# Altium schematic sheet Host_FPGA.SchDoc: Host Controller - Altera - EP3C10
size A2; Organization: Altium Limited.; Revision: 6; PageSetup: Record=PageOptions|CenterHorizontal=True|CenterVertical=True|PrintScale=0.47|XCorrection=1.00|YCorrection=1.00|PrintKind=0|BorderSize=5000000|LeftOffset=0|BottomOffset=0|Orientation=2|PaperLength=1000|PaperWidth=1000|Scale=100|PaperSource=7|PrintQuality=1200|MediaType=1|DitherType=10|PaperKind=A4 (210 x 297 mm)|PrintScaleMode=1
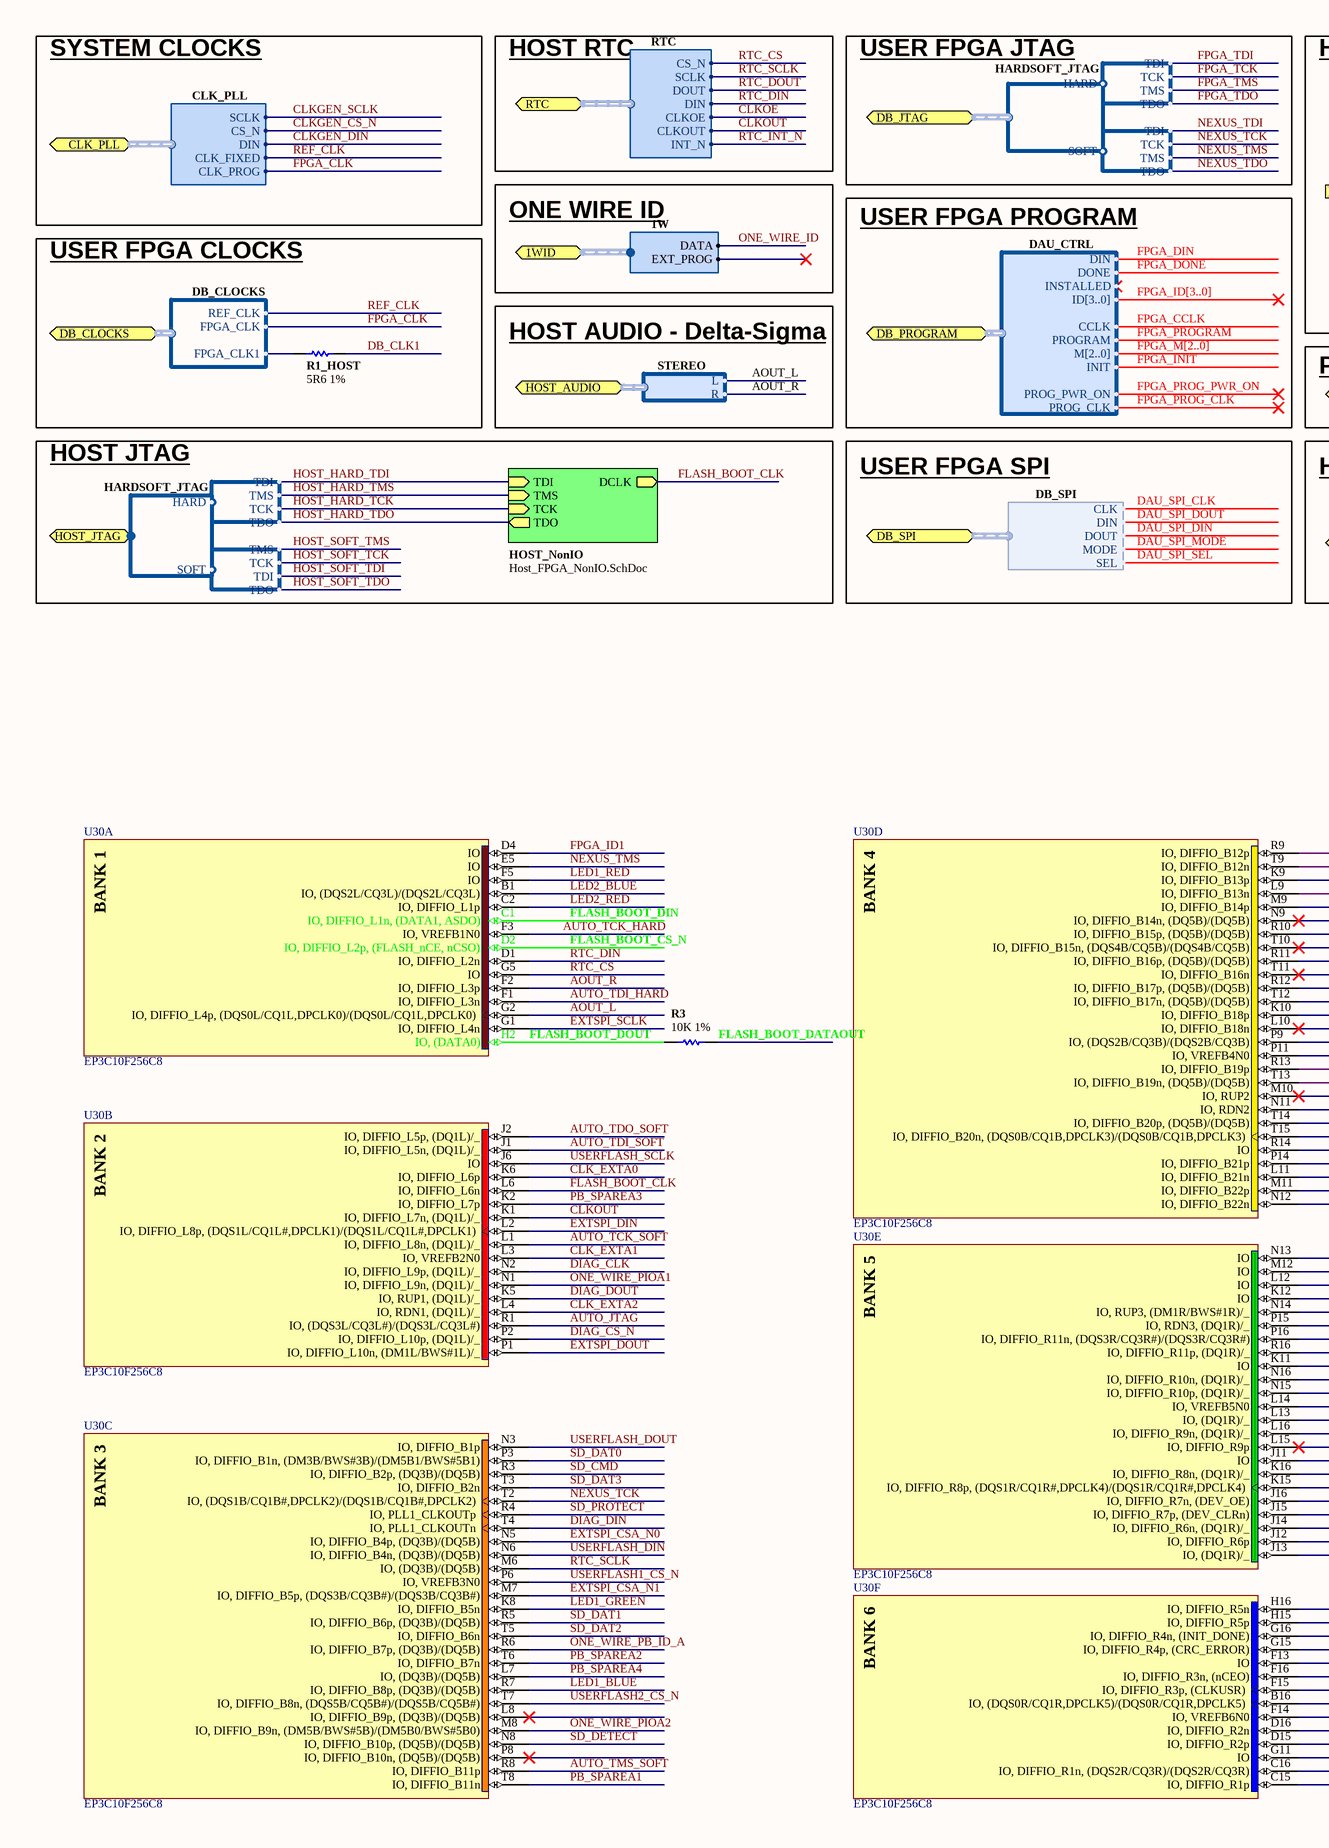
[diagram p0: Host_FPGA.SchDoc, left]
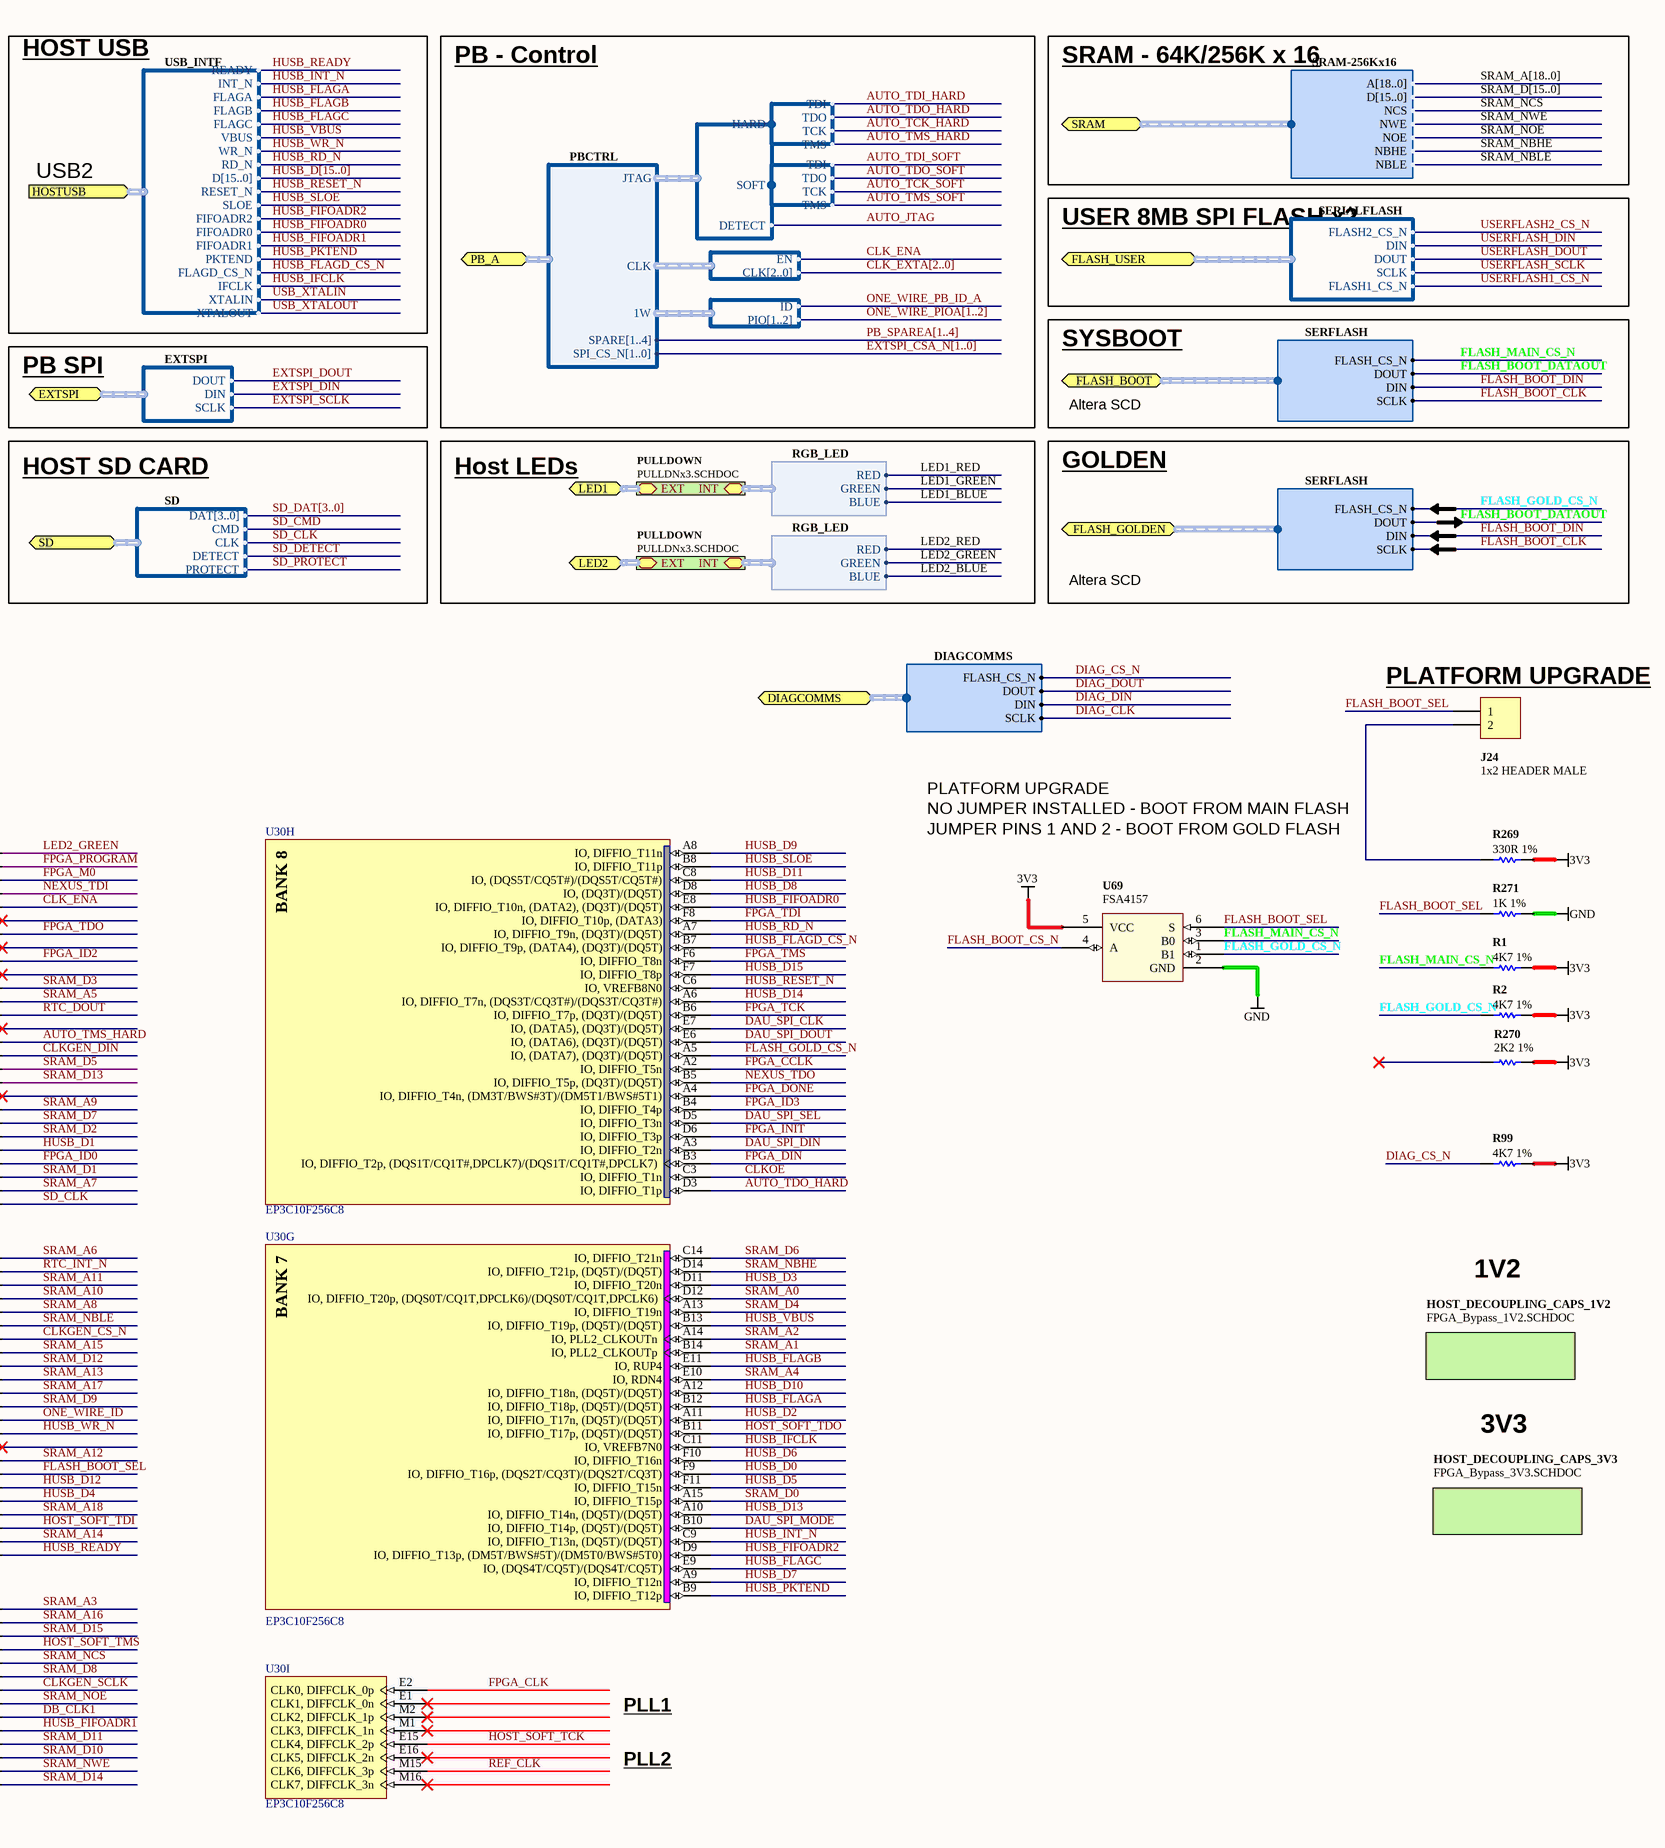
[diagram p1: Host_FPGA.SchDoc, right]

## Parts
J24  1x2 HEADER MALE  [HDR1X2]
R1  4K7 1%  [RESC1005-STAR]
R1_HOST  5R6 1%  [RESC1005-STAR]
R2  4K7 1%  [RESC1005-STAR]
R3  10K 1%  [RESC1005-STAR]
R99  4K7 1%  [RESC1005-STAR]
R269  330R 1%  [RESC1005-STAR]
R270  2K2 1%  [RESC1005-STAR]
R271  1K 1%  [RESC1005-STAR]
U30  EP3C10F256C8  [FBGA256-2]  (parts A,B,C,D,E,F,G,H,I of 13)
U69  FSA4157  [SC70_6L]

## Blocks framed on the sheet
USER FPGA CLOCKS: R1_HOST

## Sub-sheets
HOST_DECOUPLING_CAPS_1V2 = FPGA_Bypass_1V2.SCHDOC: no entries
HOST_DECOUPLING_CAPS_3V3 = FPGA_Bypass_3V3.SCHDOC: no entries
HOST_NonIO = Host_FPGA_NonIO.SchDoc: TMS (in), TCK (in), TDI (in), TDO (out), DCLK (out)
PULLDOWN = PULLDNx3.SCHDOC: EXT, INT (harness RGB_LED)
PULLDOWN = PULLDNx3.SCHDOC: EXT, INT (harness RGB_LED)

## Ports
1WID (harness 1W), CLK_PLL (harness CLK_PLL), DB_CLOCKS (harness DB_CLOCKS), DB_JTAG (harness HARDSOFT_JTAG), DB_PROGRAM (harness DAU_CTRL), DB_SPI (harness DB_SPI), DIAGCOMMS (harness DIAGCOMMS), EXTSPI (harness EXTSPI), FLASH_BOOT (harness SERFLASH), FLASH_GOLDEN (harness SERFLASH), FLASH_USER (harness SERIALFLASH), HOST_AUDIO (harness STEREO), HOST_JTAG (harness HARDSOFT_JTAG), HOSTUSB (harness USB_INTF), LED1 (harness RGB_LED), LED2 (harness RGB_LED), PB_A (harness PBCTRL), RTC (harness RTC), SD (harness SD), SRAM (harness SRAM-256Kx16)

## Harnesses
SERIALFLASH: FLASH2_CS_N, DIN, DOUT, SCLK, FLASH1_CS_N
JTAG: TMS, TDO, TDI, TCK
HARDSOFT_JTAG: HARD, SOFT
SD: DAT[3..0], CMD, CLK, DETECT, PROTECT
STEREO: L, R
RTC: CS_N, DIN, DOUT, INT_N, SCLK, CLKOUT, CLKOE
DAU_CTRL: DIN, DONE, INSTALLED, ID[3..0], CCLK, PROGRAM, M[2..0], INIT, PROG_PWR_ON, PROG_CLK
1W: DATA, EXT_PROG
CLK_PLL: CLK_FIXED, CLK_PROG, CS_N, DIN, SCLK
SRAM-256Kx16: A[18..0], D[15..0], NCS, NWE, NOE, NBHE, NBLE
RGB_LED: GREEN, RED, BLUE
DB_CLOCKS: REF_CLK, FPGA_CLK, FPGA_CLK1
DB_SPI: MODE, SEL, CLK, DIN, DOUT
JTAG_CONFIG: HARD, SOFT, DETECT
JTAG: TDI, TDO, TCK, TMS
GATE_CLOCKS: EN, CLK[2..0]
ONE_WIRE: ID, PIO[1..2]
PBCTRL: JTAG, CLK, 1W, SPI_CS_N[1..0], SPARE[1..4]
EXTSPI: DOUT, DIN, SCLK
SERFLASH: DIN, DOUT, SCLK, FLASH_CS_N
USB_INTF: READY, INT_N, SLOE, FIFOADR2, FIFOADR0, FIFOADR1, PKTEND, FLAGD_CS_N, FLAGA, FLAGB, FLAGC, WR_N, RD_N, D[15..0], RESET_N, IFCLK, XTALIN, VBUS, XTALOUT
DIAGCOMMS: DIN, DOUT, SCLK, FLASH_CS_N

## Nets
3V3: R1.2 R2.2 R99.2 R269.2 R270.2 U69.5(VCC)
GND: R271.2 U69.2(GND)
AOUT_L: U30.G2(IO,_DIFFIO_L4p,_(DQS0L/CQ1L,DPCLK0)/(DQS0L/CQ1L,DPCLK0)) ; port HOST_AUDIO.L
AOUT_R: U30.F2(IO,_DIFFIO_L3p) ; port HOST_AUDIO.R
AUTO_JTAG: U30.R1(IO,_(DQS3L/CQ3L#)/(DQS3L/CQ3L#)) ; harness JTAG_CONFIG.DETECT
AUTO_TCK_HARD: U30.F3(IO,_VREFB1N0) ; harness JTAG.TCK
AUTO_TCK_SOFT: U30.L1(IO,_DIFFIO_L8n,_(DQ1L)/_) ; harness JTAG.TCK
AUTO_TDI_HARD: U30.F1(IO,_DIFFIO_L3n) ; harness JTAG.TDI
AUTO_TDI_SOFT: U30.J1(IO,_DIFFIO_L5n,_(DQ1L)/_) ; harness JTAG.TDI
AUTO_TDO_HARD: U30.D3(IO,_DIFFIO_T1p) ; harness JTAG.TDO
AUTO_TDO_SOFT: U30.J2(IO,_DIFFIO_L5p,_(DQ1L)/_) ; harness JTAG.TDO
AUTO_TMS_HARD: U30.P9(IO,_(DQS2B/CQ3B)/(DQS2B/CQ3B)) ; harness JTAG.TMS
AUTO_TMS_SOFT: U30.R8(IO,_DIFFIO_B11p) ; harness JTAG.TMS
CLK_ENA: U30.M9(IO,_DIFFIO_B14p) ; harness GATE_CLOCKS.EN
CLK_EXTA0: U30.K6(IO,_DIFFIO_L6p)
CLK_EXTA1: U30.L3(IO,_VREFB2N0)
CLK_EXTA2: U30.L4(IO,_RDN1,_(DQ1L)/_)
CLKGEN_CS_N: U30.P16(IO,_DIFFIO_R11n,_(DQS3R/CQ3R#)/(DQS3R/CQ3R#)) ; port CLK_PLL.CS_N
CLKGEN_DIN: U30.P11(IO,_VREFB4N0) ; port CLK_PLL.DIN
CLKGEN_SCLK: U30.F15(IO,_DIFFIO_R3p,_(CLKUSR)) ; port CLK_PLL.SCLK
CLKOE: U30.C3(IO,_DIFFIO_T1n) ; port RTC.CLKOE
CLKOUT: U30.K1(IO,_DIFFIO_L7n,_(DQ1L)/_) ; port RTC.CLKOUT
DAU_SPI_CLK: U30.E7(IO,_(DATA5),_(DQ3T)/(DQ5T)) ; port DB_SPI.CLK
DAU_SPI_DIN: U30.A3(IO,_DIFFIO_T2n) ; port DB_SPI.DOUT
DAU_SPI_DOUT: U30.E6(IO,_(DATA6),_(DQ3T)/(DQ5T)) ; port DB_SPI.DIN
DAU_SPI_MODE: U30.B10(IO,_DIFFIO_T14p,_(DQ5T)/(DQ5T)) ; port DB_SPI.MODE
DAU_SPI_SEL: U30.D5(IO,_DIFFIO_T3n) ; port DB_SPI.SEL
DB_CLK1: R1_HOST.1 U30.F14(IO,_VREFB6N0)
DIAG_CLK: U30.N2(IO,_DIFFIO_L9p,_(DQ1L)/_) ; port DIAGCOMMS.SCLK
DIAG_CS_N: R99.1 U30.P2(IO,_DIFFIO_L10p,_(DQ1L)/_) ; port DIAGCOMMS.FLASH_CS_N
DIAG_DIN: U30.T4(IO,_PLL1_CLKOUTn) ; port DIAGCOMMS.DIN
DIAG_DOUT: U30.K5(IO,_RUP1,_(DQ1L)/_) ; port DIAGCOMMS.DOUT
EXTSPI_CSA_N0: U30.N5(IO,_DIFFIO_B4p,_(DQ3B)/(DQ5B))
EXTSPI_CSA_N1: U30.M7(IO,_DIFFIO_B5p,_(DQS3B/CQ3B#)/(DQS3B/CQ3B#))
EXTSPI_DIN: U30.L2(IO,_DIFFIO_L8p,_(DQS1L/CQ1L#,DPCLK1)/(DQS1L/CQ1L#,DPCLK1)) ; port EXTSPI.DIN
EXTSPI_DOUT: U30.P1(IO,_DIFFIO_L10n,_(DM1L/BWS#1L)/_) ; port EXTSPI.DOUT
EXTSPI_SCLK: U30.G1(IO,_DIFFIO_L4n) ; port EXTSPI.SCLK
FLASH_BOOT_CLK: U30.L6(IO,_DIFFIO_L6n) ; sheet HOST_NonIO/DCLK, port FLASH_BOOT.SCLK, port FLASH_GOLDEN.SCLK
FLASH_BOOT_CS_N: U30.D2(IO,_DIFFIO_L2p,_(FLASH_nCE,_nCSO)) U69.4(A)
FLASH_BOOT_DATAOUT: R3.2 ; port FLASH_BOOT.DOUT, port FLASH_GOLDEN.DOUT
FLASH_BOOT_DIN: U30.C1(IO,_DIFFIO_L1n,_(DATA1,_ASDO)) ; port FLASH_BOOT.DIN, port FLASH_GOLDEN.DIN
FLASH_BOOT_DOUT: R3.1 U30.H2(IO,_(DATA0))
FLASH_BOOT_SEL: J24.1 R271.1 U30.K16(IO,_DIFFIO_R8n,_(DQ1R)/_) U69.6(S)
FLASH_GOLD_CS_N: R2.1 U30.A5(IO,_(DATA7),_(DQ3T)/(DQ5T)) U69.1(B1) ; port FLASH_GOLDEN.FLASH_CS_N
FLASH_MAIN_CS_N: R1.1 U69.3(B0) ; port FLASH_BOOT.FLASH_CS_N
FPGA_CCLK: U30.A2(IO,_DIFFIO_T5n) ; port DB_PROGRAM.CCLK
FPGA_CLK: U30.E2(CLK0,_DIFFCLK_0p) ; port CLK_PLL.CLK_PROG, port DB_CLOCKS.FPGA_CLK
FPGA_DIN: U30.B3(IO,_DIFFIO_T2p,_(DQS1T/CQ1T#,DPCLK7)/(DQS1T/CQ1T#,DPCLK7)) ; port DB_PROGRAM.DIN
FPGA_DONE: U30.A4(IO,_DIFFIO_T4n,_(DM3T/BWS#3T)/(DM5T1/BWS#5T1)) ; port DB_PROGRAM.DONE
FPGA_ID0: U30.P14(IO,_DIFFIO_B21p)
FPGA_ID1: U30.D4(IO)
FPGA_ID2: U30.R11(IO,_DIFFIO_B16p,_(DQ5B)/(DQ5B))
FPGA_ID3: U30.B4(IO,_DIFFIO_T4p)
FPGA_INIT: U30.D6(IO,_DIFFIO_T3p) ; port DB_PROGRAM.INIT
FPGA_M0: U30.K9(IO,_DIFFIO_B13p)
FPGA_PROG_CLK: port DB_PROGRAM.PROG_CLK
FPGA_PROG_PWR_ON: port DB_PROGRAM.PROG_PWR_ON
FPGA_PROGRAM: U30.T9(IO,_DIFFIO_B12n) ; port DB_PROGRAM.PROGRAM
FPGA_TCK: U30.B6(IO,_DIFFIO_T7p,_(DQ3T)/(DQ5T)) ; harness JTAG.TCK
FPGA_TDI: U30.F8(IO,_DIFFIO_T10p,_(DATA3)) ; harness JTAG.TDI
FPGA_TDO: U30.R10(IO,_DIFFIO_B15p,_(DQ5B)/(DQ5B)) ; harness JTAG.TDO
FPGA_TMS: U30.F6(IO,_DIFFIO_T8n) ; harness JTAG.TMS
HOST_HARD_TCK: sheet HOST_NonIO/TCK, harness JTAG.TCK
HOST_HARD_TDI: sheet HOST_NonIO/TDI, harness JTAG.TDI
HOST_HARD_TDO: sheet HOST_NonIO/TDO, harness JTAG.TDO
HOST_HARD_TMS: sheet HOST_NonIO/TMS, harness JTAG.TMS
HOST_SOFT_TCK: U30.E15(CLK4,_DIFFCLK_2p) ; harness JTAG.TCK
HOST_SOFT_TDI: U30.J14(IO,_DIFFIO_R6n,_(DQ1R)/_) ; harness JTAG.TDI
HOST_SOFT_TDO: U30.B11(IO,_DIFFIO_T17p,_(DQ5T)/(DQ5T)) ; harness JTAG.TDO
HOST_SOFT_TMS: U30.G15(IO,_DIFFIO_R4p,_(CRC_ERROR)) ; harness JTAG.TMS
HUSB_D0: U30.F9(IO,_DIFFIO_T16p,_(DQS2T/CQ3T)/(DQS2T/CQ3T))
HUSB_D1: U30.R14(IO)
HUSB_D2: U30.A11(IO,_DIFFIO_T17n,_(DQ5T)/(DQ5T))
HUSB_D3: U30.D11(IO,_DIFFIO_T20n)
HUSB_D4: U30.J16(IO,_DIFFIO_R7n,_(DEV_OE))
HUSB_D5: U30.F11(IO,_DIFFIO_T15n)
HUSB_D6: U30.F10(IO,_DIFFIO_T16n)
HUSB_D7: U30.A9(IO,_DIFFIO_T12n)
HUSB_D8: U30.D8(IO,_(DQ3T)/(DQ5T))
HUSB_D9: U30.A8(IO,_DIFFIO_T11n)
HUSB_D10: U30.A12(IO,_DIFFIO_T18n,_(DQ5T)/(DQ5T))
HUSB_D11: U30.C8(IO,_(DQS5T/CQ5T#)/(DQS5T/CQ5T#))
HUSB_D12: U30.K15(IO,_DIFFIO_R8p,_(DQS1R/CQ1R#,DPCLK4)/(DQS1R/CQ1R#,DPCLK4))
HUSB_D13: U30.A10(IO,_DIFFIO_T14n,_(DQ5T)/(DQ5T))
HUSB_D14: U30.A6(IO,_DIFFIO_T7n,_(DQS3T/CQ3T#)/(DQS3T/CQ3T#))
HUSB_D15: U30.F7(IO,_DIFFIO_T8p)
HUSB_FIFOADR0: U30.E8(IO,_DIFFIO_T10n,_(DATA2),_(DQ3T)/(DQ5T)) ; port HOSTUSB.FIFOADR0
HUSB_FIFOADR1: U30.D16(IO,_DIFFIO_R2n) ; port HOSTUSB.FIFOADR1
HUSB_FIFOADR2: U30.D9(IO,_DIFFIO_T13p,_(DM5T/BWS#5T)/(DM5T0/BWS#5T0)) ; port HOSTUSB.FIFOADR2
HUSB_FLAGA: U30.B12(IO,_DIFFIO_T18p,_(DQ5T)/(DQ5T)) ; port HOSTUSB.FLAGA
HUSB_FLAGB: U30.E11(IO,_RUP4) ; port HOSTUSB.FLAGB
HUSB_FLAGC: U30.E9(IO,_(DQS4T/CQ5T)/(DQS4T/CQ5T)) ; port HOSTUSB.FLAGC
HUSB_FLAGD_CS_N: U30.B7(IO,_DIFFIO_T9p,_(DATA4),_(DQ3T)/(DQ5T)) ; port HOSTUSB.FLAGD_CS_N
HUSB_IFCLK: U30.C11(IO,_VREFB7N0) ; port HOSTUSB.IFCLK
HUSB_INT_N: U30.C9(IO,_DIFFIO_T13n,_(DQ5T)/(DQ5T)) ; port HOSTUSB.INT_N
HUSB_PKTEND: U30.B9(IO,_DIFFIO_T12p) ; port HOSTUSB.PKTEND
HUSB_RD_N: U30.A7(IO,_DIFFIO_T9n,_(DQ3T)/(DQ5T)) ; port HOSTUSB.RD_N
HUSB_READY: U30.J13(IO,_(DQ1R)/_) ; port HOSTUSB.READY
HUSB_RESET_N: U30.C6(IO,_VREFB8N0) ; port HOSTUSB.RESET_N
HUSB_SLOE: U30.B8(IO,_DIFFIO_T11p) ; port HOSTUSB.SLOE
HUSB_VBUS: U30.B13(IO,_DIFFIO_T19p,_(DQ5T)/(DQ5T)) ; port HOSTUSB.VBUS
HUSB_WR_N: U30.L16(IO,_DIFFIO_R9n,_(DQ1R)/_) ; port HOSTUSB.WR_N
LED1_BLUE: U30.R7(IO,_DIFFIO_B8p,_(DQ3B)/(DQ5B)) ; sheet PULLDOWN/INT.BLUE
LED1_GREEN: U30.K8(IO,_DIFFIO_B5n) ; sheet PULLDOWN/INT.GREEN
LED1_RED: U30.F5(IO) ; sheet PULLDOWN/INT.RED
LED2_BLUE: U30.B1(IO,_(DQS2L/CQ3L)/(DQS2L/CQ3L)) ; sheet PULLDOWN/INT.BLUE
LED2_GREEN: U30.R9(IO,_DIFFIO_B12p) ; sheet PULLDOWN/INT.GREEN
LED2_RED: U30.C2(IO,_DIFFIO_L1p) ; sheet PULLDOWN/INT.RED
NEXUS_TCK: U30.T2(IO,_(DQS1B/CQ1B#,DPCLK2)/(DQS1B/CQ1B#,DPCLK2)) ; harness JTAG.TCK
NEXUS_TDI: U30.L9(IO,_DIFFIO_B13n) ; harness JTAG.TDI
NEXUS_TDO: U30.B5(IO,_DIFFIO_T5p,_(DQ3T)/(DQ5T)) ; harness JTAG.TDO
NEXUS_TMS: U30.E5(IO) ; harness JTAG.TMS
ONE_WIRE_ID: U30.L13(IO,_(DQ1R)/_) ; port 1WID.DATA
ONE_WIRE_PB_ID_A: U30.R6(IO,_DIFFIO_B7p,_(DQ3B)/(DQ5B)) ; harness ONE_WIRE.ID
ONE_WIRE_PIOA1: U30.N1(IO,_DIFFIO_L9n,_(DQ1L)/_)
ONE_WIRE_PIOA2: U30.M8(IO,_DIFFIO_B9n,_(DM5B/BWS#5B)/(DM5B0/BWS#5B0))
PB_SPAREA1: U30.T8(IO,_DIFFIO_B11n)
PB_SPAREA2: U30.T6(IO,_DIFFIO_B7n)
PB_SPAREA3: U30.K2(IO,_DIFFIO_L7p)
PB_SPAREA4: U30.L7(IO,_(DQ3B)/(DQ5B))
REF_CLK: U30.M15(CLK6,_DIFFCLK_3p) ; port CLK_PLL.CLK_FIXED, port DB_CLOCKS.REF_CLK
RTC_CS: U30.G5(IO) ; port RTC.CS_N
RTC_DIN: U30.D1(IO,_DIFFIO_L2n) ; port RTC.DIN
RTC_DOUT: U30.K10(IO,_DIFFIO_B18p) ; port RTC.DOUT
RTC_INT_N: U30.M12(IO) ; port RTC.INT_N
RTC_SCLK: U30.M6(IO,_(DQ3B)/(DQ5B)) ; port RTC.SCLK
SD_CLK: U30.N12(IO,_DIFFIO_B22n) ; port SD.CLK
SD_CMD: U30.R3(IO,_DIFFIO_B2p,_(DQ3B)/(DQ5B)) ; port SD.CMD
SD_DAT0: U30.P3(IO,_DIFFIO_B1n,_(DM3B/BWS#3B)/(DM5B1/BWS#5B1))
SD_DAT1: U30.R5(IO,_DIFFIO_B6p,_(DQ3B)/(DQ5B))
SD_DAT2: U30.T5(IO,_DIFFIO_B6n)
SD_DAT3: U30.T3(IO,_DIFFIO_B2n)
SD_DETECT: U30.N8(IO,_DIFFIO_B10p,_(DQ5B)/(DQ5B)) ; port SD.DETECT
SD_PROTECT: U30.R4(IO,_PLL1_CLKOUTp) ; port SD.PROTECT
SRAM_A0: U30.D12(IO,_DIFFIO_T20p,_(DQS0T/CQ1T,DPCLK6)/(DQS0T/CQ1T,DPCLK6))
SRAM_A1: U30.B14(IO,_PLL2_CLKOUTp)
SRAM_A2: U30.A14(IO,_PLL2_CLKOUTn)
SRAM_A3: U30.H16(IO,_DIFFIO_R5n)
SRAM_A4: U30.E10(IO,_RDN4)
SRAM_A5: U30.T12(IO,_DIFFIO_B17n,_(DQ5B)/(DQ5B))
SRAM_A6: U30.N13(IO)
SRAM_A7: U30.M11(IO,_DIFFIO_B22p)
SRAM_A8: U30.N14(IO,_RUP3,_(DM1R/BWS#1R)/_)
SRAM_A9: U30.N11(IO,_RDN2)
SRAM_A10: U30.K12(IO)
SRAM_A11: U30.L12(IO)
SRAM_A12: U30.J11(IO)
SRAM_A13: U30.N16(IO,_DIFFIO_R10n,_(DQ1R)/_)
SRAM_A14: U30.J12(IO,_DIFFIO_R6p)
SRAM_A15: U30.R16(IO,_DIFFIO_R11p,_(DQ1R)/_)
SRAM_A16: U30.H15(IO,_DIFFIO_R5p)
SRAM_A17: U30.N15(IO,_DIFFIO_R10p,_(DQ1R)/_)
SRAM_A18: U30.J15(IO,_DIFFIO_R7p,_(DEV_CLRn))
SRAM_D0: U30.A15(IO,_DIFFIO_T15p)
SRAM_D1: U30.L11(IO,_DIFFIO_B21n)
SRAM_D2: U30.T15(IO,_DIFFIO_B20n,_(DQS0B/CQ1B,DPCLK3)/(DQS0B/CQ1B,DPCLK3))
SRAM_D3: U30.R12(IO,_DIFFIO_B17p,_(DQ5B)/(DQ5B))
SRAM_D4: U30.A13(IO,_DIFFIO_T19n)
SRAM_D5: U30.R13(IO,_DIFFIO_B19p)
SRAM_D6: U30.C14(IO,_DIFFIO_T21n)
SRAM_D7: U30.T14(IO,_DIFFIO_B20p,_(DQ5B)/(DQ5B))
SRAM_D8: U30.F16(IO,_DIFFIO_R3n,_(nCEO))
SRAM_D9: U30.L14(IO,_VREFB5N0)
SRAM_D10: U30.G11(IO)
SRAM_D11: U30.D15(IO,_DIFFIO_R2p)
SRAM_D12: U30.K11(IO)
SRAM_D13: U30.T13(IO,_DIFFIO_B19n,_(DQ5B)/(DQ5B))
SRAM_D14: U30.C15(IO,_DIFFIO_R1p)
SRAM_D15: U30.G16(IO,_DIFFIO_R4n,_(INIT_DONE))
SRAM_NBHE: U30.D14(IO,_DIFFIO_T21p,_(DQ5T)/(DQ5T)) ; port SRAM.NBHE
SRAM_NBLE: U30.P15(IO,_RDN3,_(DQ1R)/_) ; port SRAM.NBLE
SRAM_NCS: U30.F13(IO) ; port SRAM.NCS
SRAM_NOE: U30.B16(IO,_(DQS0R/CQ1R,DPCLK5)/(DQS0R/CQ1R,DPCLK5)) ; port SRAM.NOE
SRAM_NWE: U30.C16(IO,_DIFFIO_R1n,_(DQS2R/CQ3R)/(DQS2R/CQ3R)) ; port SRAM.NWE
USB_XTALIN: port HOSTUSB.XTALIN
USB_XTALOUT: port HOSTUSB.XTALOUT
USERFLASH1_CS_N: U30.P6(IO,_VREFB3N0) ; port FLASH_USER.FLASH1_CS_N
USERFLASH2_CS_N: U30.T7(IO,_DIFFIO_B8n,_(DQS5B/CQ5B#)/(DQS5B/CQ5B#)) ; port FLASH_USER.FLASH2_CS_N
USERFLASH_DIN: U30.N6(IO,_DIFFIO_B4n,_(DQ3B)/(DQ5B)) ; port FLASH_USER.DIN
USERFLASH_DOUT: U30.N3(IO,_DIFFIO_B1p) ; port FLASH_USER.DOUT
USERFLASH_SCLK: U30.J6(IO) ; port FLASH_USER.SCLK
NetJ24_2: J24.2 R269.1
NetR1_HOST_2: R1_HOST.2 ; port DB_CLOCKS.FPGA_CLK1

Not connected (* = marked no-connect by the designer): R270 1*; U30 E1(CLK1,_DIFFCLK_0n)* E16(CLK5,_DIFFCLK_2n)* L8(IO,_DIFFIO_B9p,_(DQ3B)/(DQ5B))* L10(IO,_DIFFIO_B18n)* L15(IO,_DIFFIO_R9p)* M1(CLK3,_DIFFCLK_1n)* M2(CLK2,_DIFFCLK_1p)* M10(IO,_RUP2)* M16(CLK7,_DIFFCLK_3n)* N9(IO,_DIFFIO_B14n,_(DQ5B)/(DQ5B))* P8(IO,_DIFFIO_B10n,_(DQ5B)/(DQ5B))* T10(IO,_DIFFIO_B15n,_(DQS4B/CQ5B)/(DQS4B/CQ5B))* T11(IO,_DIFFIO_B16n)*

## Buses and harness runs
bus CLK_EXTA[2..0]
bus EXTSPI_CSA_N[1..0]
bus FPGA_ID[3..0]
bus FPGA_M[2..0]
bus HUSB_D[15..0]
bus ONE_WIRE_PIOA[1..2]
bus PB_SPAREA[1..4]
bus SD_DAT[3..0]
bus SRAM_A[18..0]
bus SRAM_D[15..0]
harness port LED1 = sheet PULLDOWN/EXT
harness port LED2 = sheet PULLDOWN/EXT

## Notes on the sheet
- SYSTEM CLOCKS
- HOST RTC
- USER FPGA JTAG
- HOST USB
- PB - Control
- SRAM - 64K/256K x 16
- USB2
- ONE WIRE ID
- USER FPGA PROGRAM
- USER 8MB SPI FLASH x2
- HOST AUDIO - Delta-Sigma
- PB SPI
- SYSBOOT
- HOST JTAG
- Altera SCD
- USER FPGA SPI
- HOST SD CARD
- Host LEDs
- GOLDEN
- (near J24) PLATFORM UPGRADE
- PLATFORM UPGRADE
- NO JUMPER INSTALLED - BOOT FROM MAIN FLASH
- JUMPER PINS 1 AND 2 - BOOT FROM GOLD FLASH
- 1V2
- 3V3
- PLL1
- PLL2
- Project Title
- Sheet Title
- Size:
- Date:
- File:
- A2
- Assy:
- Time:
- Revision:
- Sheet
- of
- (in symbol EP3C10F256C8, part A) BANK 1
- (in symbol EP3C10F256C8, part B) BANK 2
- (in symbol EP3C10F256C8, part C) BANK 3
- (in symbol EP3C10F256C8, part D) BANK 4
- (in symbol EP3C10F256C8, part E) BANK 5
- (in symbol EP3C10F256C8, part F) BANK 6
- (in symbol EP3C10F256C8, part G) BANK 7
- (in symbol EP3C10F256C8, part H) BANK 8

## Library data of the parts
J24 = D-300-0020: Header IDC, 2 x 1 Pin Vertical 2.54mm Pitch (Non-Boxed, Male); Max Current: 3 A; Category: Connector; Connector type: Header; Mounting Technology: Through-Hole; Pin Count: 2; Status: Production
R1 R2 R99 = D-100-0088: Resistor, 4K7 1% 0402 (1005); Power Rating: 63 mW; Resistance: 4.7 K; Category: Resistor; Mounting Technology: Surface Mount; Status: Production; Tolerance: 1 %
R1_HOST = D-100-0085: Resistor, 5R6 1% 0402 (1005); Power Rating: 63 mW; Resistance: 5.6 R; Category: Resistor; Status: Production; Mounting Technology: Surface Mount; Tolerance: 1 %
R3 = D-100-0130: Resistor, 10K 1% 0402 (1005); Power Rating: 63 mW; Category: Resistor; Mounting Technology: Surface Mount; Resistance: 10 K; Status: Production; Tolerance: 1 %
R269 = D-100-0121: UPDATE FROM UL LIBRARIES; Power Rating: 63 mW; Resistance: 1 K; Category: Resistor; Mounting Technology: Surface Mount; Status: Production; Tolerance: 1 %
R270 = D-100-0107: Resistor, 2K2 1% 0402 (1005); Power Rating: 63 mW; Resistance: 2.2 K; Category: Resistor; Mounting Technology: Surface Mount; Status: Production; Tolerance: 1 %
R271 = D-100-0130: UPDATE FROM UL LIBRARIES; Power Rating: 63 mW; Resistance: 10 K; Category: Resistor; Mounting Technology: Surface Mount; Status: Production; Tolerance: 1 %
U30 = EP3C10F256C8: Cyclone III Family FPGA, 182 I/O Pins, 4 PLLs, 256-Pin FBGA, Speed Grade 8, Commercial Grade; Published: 26-Feb-2007; DatasheetVersion: ver2.0, May-2008; PackageVersion: ver15.1, May-2008; PackageReference: FBGA256-2; Publisher: Altium Limited; PackageDescription: 256-Ball FineLine Ball Grid Array (FBGA256) - Option 2 - Wire Bond; Code_JEDEC: MO-192-DAF-1; ComponentLink1Description: Manufacturer Link; ComponentLink1URL: http://www.altera.com/; ComponentLink2Description: Handbook (7.86MB); ComponentLink2URL: http://www.altera.com/literature/hb/cyc3/cyclone3_handbook.pdf; ComponentLink3Description: Packaging Specification; ComponentLink3URL: http://www.altera.com/literature/ds/dspkg.pdf
U69 = D-200-0006: Low Voltage 1R  SPDT Analog Switc; Supply Voltage: mV; Mounting Technology: Surface Mount; Status: Unreleased; Category: IC-Analog